# EAGLE design Antlaz-v0.1 (EAGLE 8.2.0)
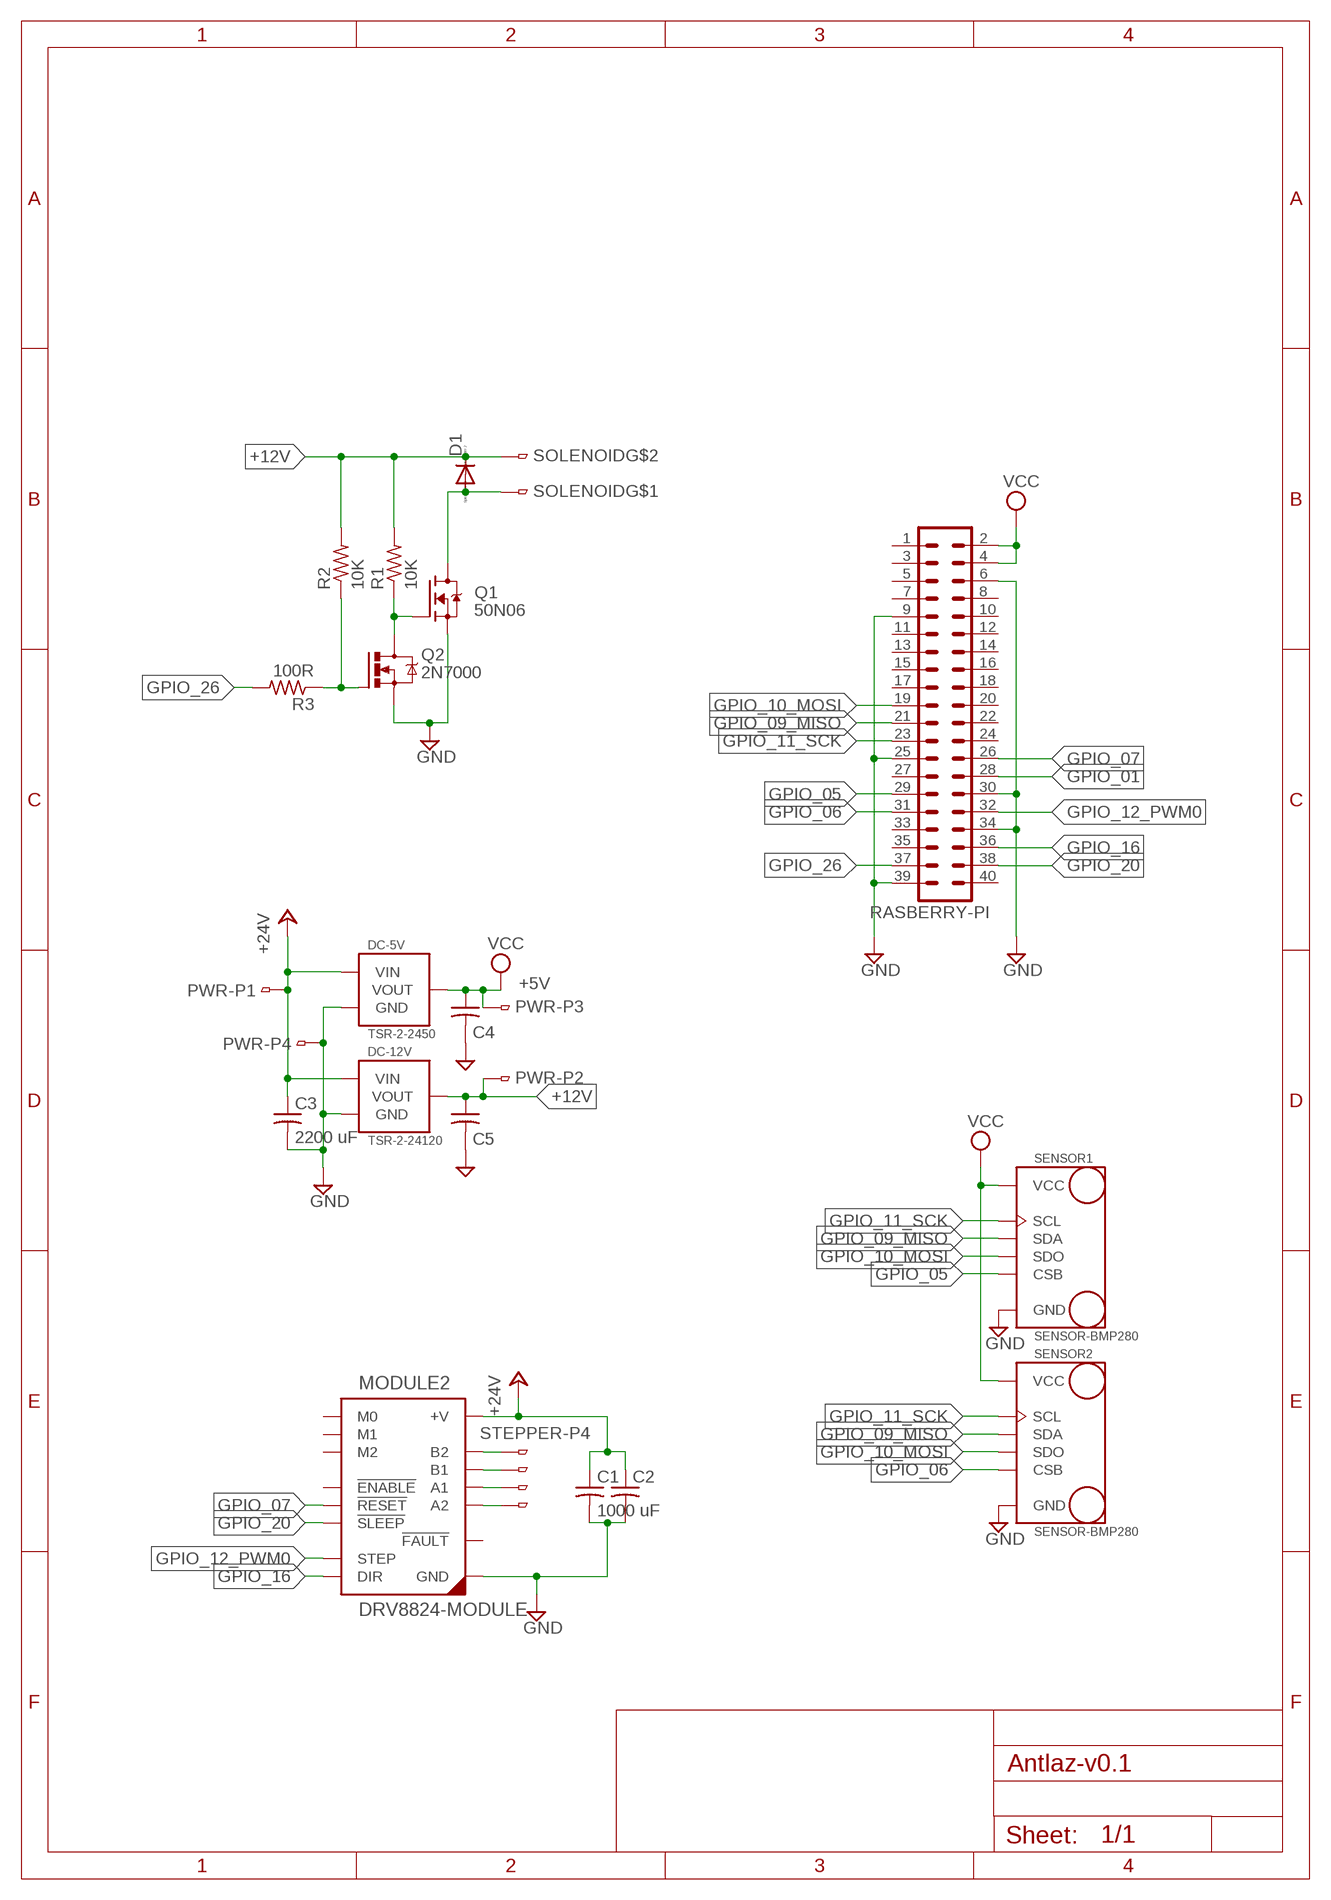
[diagram p0: schematic, sheet 1]

## Parts
C1  1000 uF  C-US_DIA-18MM  [CAP_18MM]
C2  C-US_BYPASS  [KEMET-CERMAIC]
C3  2200 uF  C-US_DIA-18MM  [CAP_18MM]
C4  C-US_BYPASS  [KEMET-CERMAIC]
C5  C-US_BYPASS  [KEMET-CERMAIC]
D1  DIODEDO07  [DO07]
DC-5V  TSR-2-2450  DC-DC_MODULE-TSR_2  [DCDC_TSR2]
DC-12V  TSR-2-24120  DC-DC_MODULE-TSR_2  [DCDC_TSR2]
MODULE2  DRV8824-MODULE  [DRV8825]
PWR  CONN-4  [CONN-PHEONIX-3,5MM-4]
Q1  50N06  NMOSFET_  [TO220]
Q2  2N7000  NMOSFET_TO92  [TO92]
R1  10K  R-US_0207/10  [0207/10]
R2  10K  R-US_0207/10  [0207/10]
R3  100R  R-US_0207/10  [0207/10]
RASBERRY-PI  MA20-2  [MA20-2]
SENSOR1  SENSOR-BMP280  [MA06-1]
SENSOR2  SENSOR-BMP280  [MA06-1]
SOLENOID  CONN-2  [CONN-PHEONIX-3,5MM-2]
STEPPER  CONN-4  [CONN-PHEONIX-3,5MM-4]

## Nets
+12V: C5.1 D1.C DC-12V.P$3(VOUT) PWR.P$2 R1.2 R2.2 SOLENOID.P$2
+24V: C1.1 C2.1 C3.1 DC-5V.P$1(VIN) DC-12V.P$1(VIN) MODULE2.P$16(+V) PWR.P$1
GND: C1.2 C2.2 C3.2 C4.2 C5.2 DC-5V.P$2(GND) DC-12V.P$2(GND) MODULE2.P$9(GND) MODULE2.P$15(GND) PWR.P$4 Q1.3(S) Q2.3(S) RASBERRY-PI.6 RASBERRY-PI.9 RASBERRY-PI.25 RASBERRY-PI.30 RASBERRY-PI.34 RASBERRY-PI.39 SENSOR1.2(GND) SENSOR2.2(GND)
GPIO_01: RASBERRY-PI.28
GPIO_05: RASBERRY-PI.29 SENSOR1.5(CSB)
GPIO_06: RASBERRY-PI.31 SENSOR2.5(CSB)
GPIO_07: MODULE2.P$5(!RESET) RASBERRY-PI.26
GPIO_09_MISO: RASBERRY-PI.21 SENSOR1.4(SDA) SENSOR2.4(SDA)
GPIO_10_MOSI: RASBERRY-PI.19 SENSOR1.6(SDO) SENSOR2.6(SDO)
GPIO_11_SCK: RASBERRY-PI.23 SENSOR1.3(SCL) SENSOR2.3(SCL)
GPIO_12_PWM0: MODULE2.P$7(STEP) RASBERRY-PI.32
GPIO_16: MODULE2.P$8(DIR) RASBERRY-PI.36
GPIO_20: MODULE2.P$6(!SLEEP) RASBERRY-PI.38
GPIO_26: R3.2 RASBERRY-PI.37
N$1: Q2.2(G) R2.1 R3.1
N$3: MODULE2.P$14(B2) STEPPER.P$4
N$4: MODULE2.P$13(B1) STEPPER.P$3
N$5: MODULE2.P$12(A1) STEPPER.P$2
N$7: MODULE2.P$11(A2) STEPPER.P$1
N$8: D1.A Q1.2(D) SOLENOID.P$1
N$9: Q1.1(G) Q2.1(D) R1.1
VCC: C4.1 DC-5V.P$3(VOUT) PWR.P$3 RASBERRY-PI.2 RASBERRY-PI.4 SENSOR1.1(VCC) SENSOR2.1(VCC)
Unconnected: MODULE2.P$1(!ENABLE) MODULE2.P$2(M0) MODULE2.P$3(M1) MODULE2.P$4(M2) MODULE2.P$10(!FAULT) RASBERRY-PI.1 RASBERRY-PI.3 RASBERRY-PI.5 RASBERRY-PI.7 RASBERRY-PI.8 RASBERRY-PI.10 RASBERRY-PI.11 RASBERRY-PI.12 RASBERRY-PI.13 RASBERRY-PI.14 RASBERRY-PI.15 RASBERRY-PI.16 RASBERRY-PI.17 RASBERRY-PI.18 RASBERRY-PI.20 RASBERRY-PI.22 RASBERRY-PI.24 RASBERRY-PI.27 RASBERRY-PI.33 RASBERRY-PI.35 RASBERRY-PI.40

## Notes on the sheet
- +5V

## Library data of the parts
C1-C5 = 1M-Vent-PAPR:C-US_: CAPACITOR, American symbol
D1 = Lil-Makers:DIODE: DIODE
DC-5V DC-12V = 1M-Vent-PAPR:DC-DC_MODULE
MODULE2 = 1M-Vent-PAPR:DRV8824-MODULE
PWR STEPPER = 1M-Vent-PAPR:CONN-4
Q1 = 1M-Vent-PAPR:NMOSFET_
Q2 = Transistor:NMOSFET: N-Channel MOSFET - Generic; CATEGORY: Transistor; SUB-CATEGORY: MOSFET; TYPE: N-Channel
R1-R3 = 1M-Vent-PAPR:R-US_: RESISTOR, American symbol
RASBERRY-PI = con-lstb:MA20-2: PIN HEADER; OC_FARNELL: unknown; OC_NEWARK: unknown
SENSOR1 SENSOR2 = 1M-Vent-PAPR:SENSOR-BMP280
SOLENOID = 1M-Vent-PAPR:CONN-2

## Board
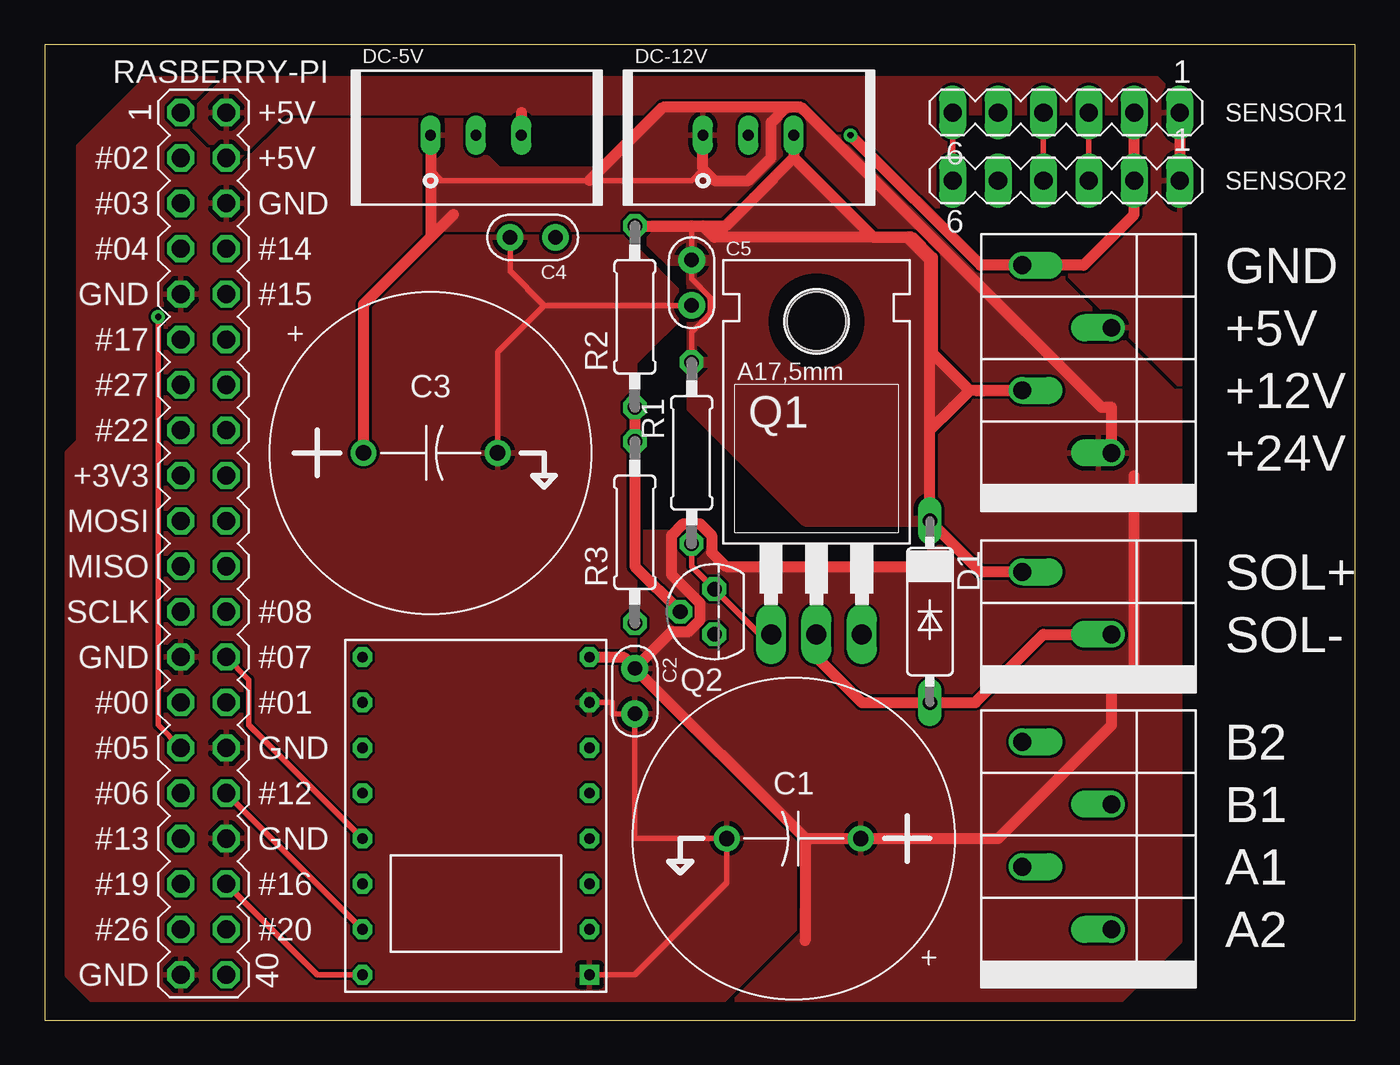
[diagram p1: board, top side]
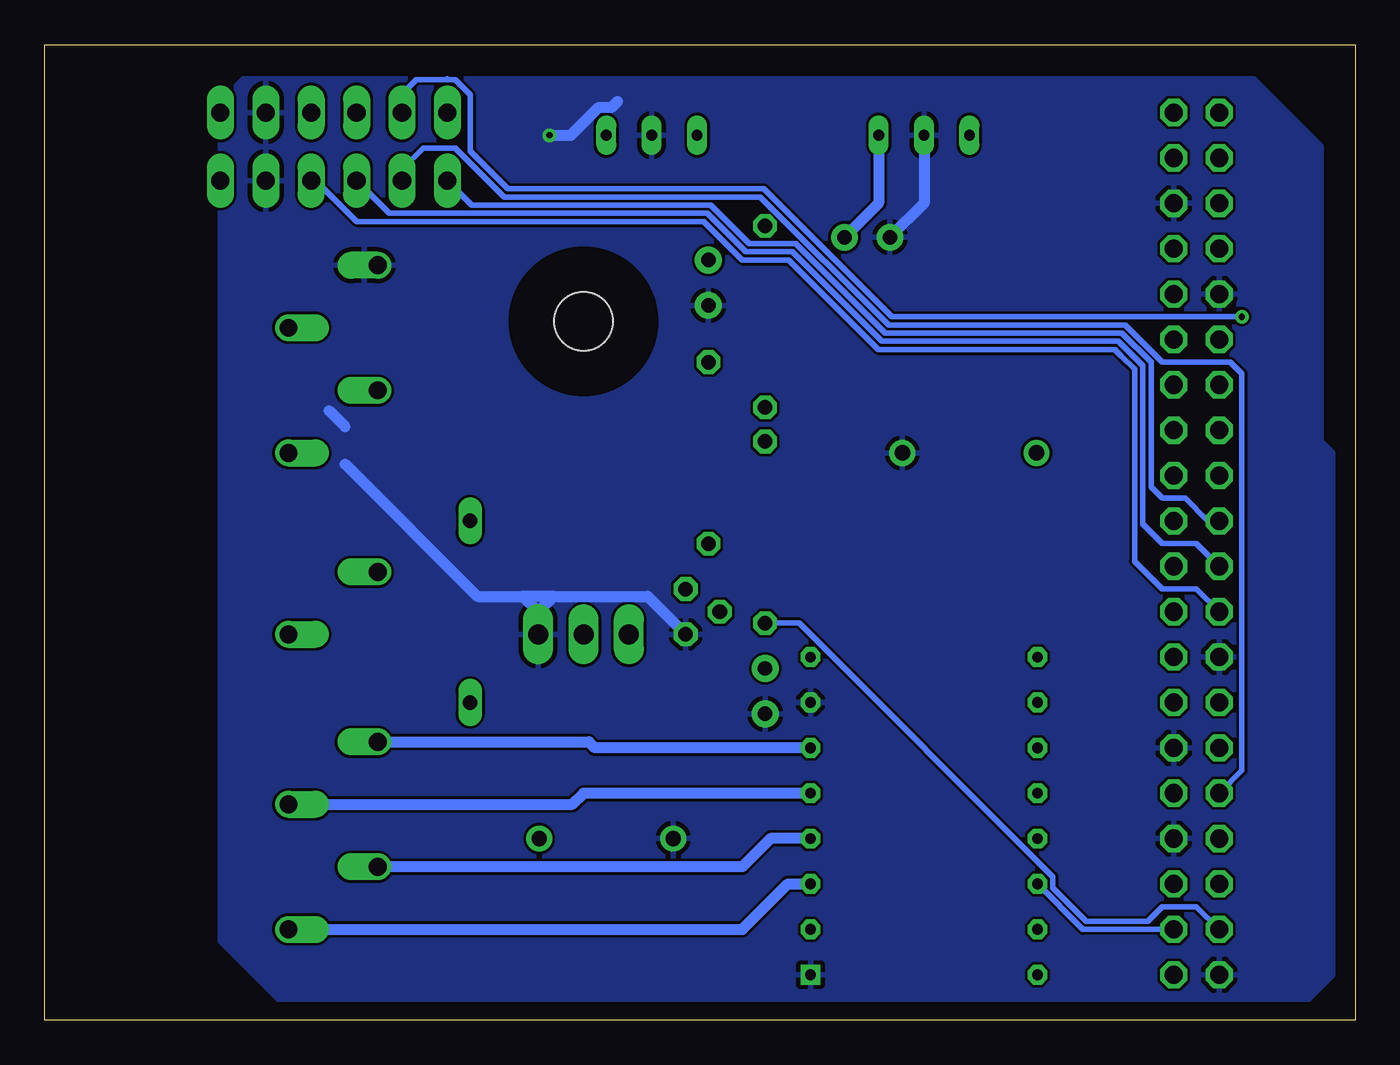
[diagram p2: board, bottom side, seen from below]

Size 73.33 x 54.6 mm. Coordinates in mm from the lower left corner, seen from the top.
Outline: 0,0 73.33,0 73.33,54.6 0,54.6 0,0
Copper layers (1*16): Top 0.035mm / dielectric 1.5mm / Bottom 0.035mm
Design rules "default": minimum track width 6mil, minimum drill 0.35mm, track to track 6mil, track to pad 6mil, pad to pad 6mil, via to via 6mil, smd to smd 6mil, copper to edge 40mil, drill to drill 6mil, minimum pad ring 10mil, minimum via ring 8mil, stop-mask expansion 4mil, vias tented up to drill 0mil, thermal gap 10mil

### Footprints (pad centres in the part's own frame; a part is rotated, then mirrored left to right if it is on the bottom)
CAP_18MM = drill 0.85 pad 1.45: 1 -3.75,0; 2 3.75,0
KEMET-CERMAIC = drill 0.8 pad 1.5: 1 -1.27,0; 2 1.27,0
DO07 = drill 0.813 long: A 5.08,0; C -5.08,0
DCDC_TSR2 = drill 0.6 long: P$1 -2.54,0; P$2 0,0; P$3 2.54,0
DRV8825 = drill 0.6 octagon: P$1 -6.35,6.35; P$2 -6.35,3.81; P$3 -6.35,1.27; P$4 -6.35,-1.27; P$5 -6.35,-3.81; P$6 -6.35,-6.35; P$7 -6.35,-8.89; P$8 -6.35,-11.43; P$10 6.35,-8.89; P$11 6.35,-6.35; P$12 6.35,-3.81; P$13 6.35,-1.27; P$14 6.35,1.27; P$15 6.35,3.81; P$16 6.35,6.35 | drill 0.6 square: P$9 6.35,-11.43
CONN-PHEONIX-3,5MM-4 = drill 1 offset: P$1 0,0; P$2 3.5,5; P$3 7,0; P$4 10.5,5
TO220 = drill 1.118 long: 1 -2.54,-6.35; 2 0,-6.35; 3 2.54,-6.35 | hole 3.302: 0,11.176
TO92 = drill 0.813 octagon: 1 1.27,0; 2 0,1.905; 3 -1.27,0
0207/10 = drill 0.813 octagon: 1 -5.08,0; 2 5.08,0
MA20-2 = drill 1.016 octagon: 1 -24.13,-1.27; 2 -24.13,1.27; 3 -21.59,-1.27; 4 -21.59,1.27; 5 -19.05,-1.27; 6 -19.05,1.27; 7 -16.51,-1.27; 8 -16.51,1.27; 9 -13.97,-1.27; 10 -13.97,1.27; 11 -11.43,-1.27; 12 -11.43,1.27; 13 -8.89,-1.27; 14 -8.89,1.27; 15 -6.35,-1.27; 16 -6.35,1.27; 17 -3.81,-1.27; 18 -3.81,1.27; 19 -1.27,-1.27; 20 -1.27,1.27; 21 1.27,-1.27; 22 1.27,1.27; 23 3.81,-1.27; 24 3.81,1.27; 25 6.35,-1.27; 26 6.35,1.27; 27 8.89,-1.27; 28 8.89,1.27; 29 11.43,-1.27; 30 11.43,1.27; 31 13.97,-1.27; 32 13.97,1.27; 33 16.51,-1.27; 34 16.51,1.27; 35 19.05,-1.27; 36 19.05,1.27; 37 21.59,-1.27; 38 21.59,1.27; 39 24.13,-1.27; 40 24.13,1.27
MA06-1 = drill 1.016 long: 1 -6.35,0; 2 -3.81,0; 3 -1.27,0; 4 1.27,0; 5 3.81,0; 6 6.35,0
CONN-PHEONIX-3,5MM-2 = drill 1 offset: P$1 0,0; P$2 3.5,5

### Placement (x,y rotation side)
C1  41.91,10.16 180 top
C2  33.02,18.41 270 top
C3  21.59,31.75 0 top
C4  27.3,43.81 180 top
C5  36.2,41.27 270 top
D1  49.53,22.86 270 top
DC-5V  24.13,49.53 0 top
DC-12V  39.37,49.53 0 top
MODULE2  24.13,13.97 0 top
PWR  59.69,31.75 90 top
Q1  43.18,27.94 0 top
Q2  37.47,22.86 90 top
R1  36.2,31.75 90 top
R2  33.02,39.37 90 top
R3  33.02,27.3 270 top
RASBERRY-PI  8.89,26.67 270 top
SENSOR1  57.15,50.8 180 top
SENSOR2  57.15,46.99 180 top
SOLENOID  59.69,21.59 90 top
STEPPER  59.69,5.08 90 top

### Tracks (layer width: path | path; a pad name or v marks a point on that pad's centre or on a via)
+12V
  Top 0.305: R1.2 36.2,38.51 37.25,39.57 37.25,40.44 36.2,41.5 C5.1 36.2,44.45 | 34.29,44.45 R2.2 | 52.07,35.25 51.74,35.25 51.74,35.23 50.8,34.29
  Top 0.61: SOLENOID.P$2 52.38,25.09 D1.C 49.53,33.02 | 39.69,46.04 37.47,43.81 | 39.69,46.04 41.91,48.26 | DC-12V.P$3 41.91,48.26 | 41.91,48.26 46.35,43.81 | 46.35,43.81 48.26,43.81 | 48.26,43.81 48.53,43.81 49.67,42.68 49.67,37.33 51.74,35.25 | 52.07,35.25 PWR.P$2 51.76,35.25 50.8,34.29 49.53,33.02 | 46.35,43.81 37.47,43.81 | 48.26,43.81 49.53,42.55 49.53,33.02 | R2.2 36.2,44.45 | 36.2,44.45 36.83,44.45 37.47,43.81 | 36.2,44.45 38.1,44.45 39.69,46.04
  pour Top: 49.53,27.94 49.53,33.02 51.44,34.92 51.44,35.56 49.53,37.47 49.53,42.55 48.26,43.81 46.35,43.81 41.91,48.26 38.1,44.45 33.02,44.45 36.2,41.27 36.2,34.29 42.55,27.94
+24V
  Top 0.305: 32.38,20.32 C2.1 33.34,19.37 42.55,10.16 | 21.59,46.99 21.59,43.81 | 21.59,46.99 21.59,47.62 | 21.59,47.62 DC-5V.P$1 | 22.23,46.99 30.48,46.99 36.2,46.99 36.83,47.62 | 22.23,46.99 21.59,46.99 | 21.59,47.62 22.23,46.99
  Top 0.61: DC-12V.P$1 36.83,47.62 37.47,46.99 39.37,46.99 40.64,48.26 40.64,50.24 41.49,51.09 | PWR.P$1 59.69,34.29 59.13,34.29 42.33,51.09 41.49,51.09 | DC-5V.P$1 21.59,43.81 | 21.59,43.81 17.84,40.06 C3.1 | MODULE2.P$16 32.38,20.32 33.34,19.37 | 42.55,10.16 C2.1 35.08,21.74 36.02,21.74 36.68,22.4 36.68,23.32 35.08,24.92 35.08,27.13 35.73,27.79 36.66,27.79 37.31,27.13 37.31,26.19 38.1,25.4 50.16,25.4 | 42.55,10.16 C1.1 53.34,10.16 59.69,16.51 59.69,18.41 60.96,19.68 60.96,30.48 | 21.59,43.81 22.86,45.09 | 42.55,10.16 42.55,4.45 | 41.49,51.09 34.59,51.09 30.48,46.99
  pour Top (rank 4): 21.59,43.81 21.59,50.8 23.5,50.8 24.13,50.16 24.13,48.9 25.4,47.62 31.75,47.62 35.56,51.44 42.55,51.44 52.07,42.55 56.52,42.55 59.69,39.37 59.69,38.1 60.33,38.73 63.5,35.56 63.5,4.45 59.69,0.64 36.83,0.64 42.55,6.35 42.55,10.16 33.02,19.68 33.02,27.3 36.2,27.3 38.1,25.4 49.53,25.4 49.53,42.55 48.26,43.81 36.83,44.45 33.02,44.45 32.38,43.81
GND  (via drill 0.35)
  Top 0.305: MODULE2.P$9 33.02,2.54 38.16,7.68 C1.2 33.02,10.16 C2.2 31.75,17.14 31.75,17.78 MODULE2.P$15 | C4.2 26.04,41.91 27.94,40.01 | 27.94,40.01 C5.2 | C3.2 25.34,37.41 27.94,40.01
  Top 0.61: SENSOR1.2 SENSOR2.2 60.96,45.09 58.12,42.25 PWR.P$4 52.37,42.25 v45.09,49.53
  Bottom 0.61: 45.72,22.86 44.86,23.72 | Q2.3 39.6,23.72 44.86,23.72 | Q1.3 45.72,22.86 | 44.86,23.72 46.58,23.72 | 46.58,23.72 49.12,23.72 56.52,31.11 | 46.58,23.72 45.72,22.86 | 57.41,34.11 56.52,33.22 | DC-5V.P$2 24.13,45.72 C4.2 | 41.27,51.44 41.62,51.09 42.33,51.09 43.89,49.53 v45.09,49.53
  pour Top (rank 3): 36.2,40.01 32.38,43.81 21.59,43.81 21.59,50.8 12.06,50.8 10.16,52.7 5.71,52.7 1.91,48.9 1.91,32.38 1.27,31.75 1.27,2.54 3.17,0.64 37.47,0.64 42.55,5.71 42.55,10.16 33.02,19.68 33.02,36.83
  pour Bottom: 1.27,2.54 3.17,0.64 59.69,0.64 63.5,4.45 63.5,51.44 62.23,52.7 5.71,52.7 1.91,48.9 1.91,32.38 1.27,31.75
GPIO_05  (via drill 0.35)
  Top 0.305: RASBERRY-PI.29 6.35,16.51 v6.35,39.37
  Bottom 0.305: 50.72,52.63 50.36,52.63 49.53,51.8 49.53,48.64 47.43,46.53 33.09,46.53 25.93,39.37 v6.35,39.37 | 50.72,52.63 50.8,52.7 | SENSOR1.5 53.34,51.82 52.53,52.63 50.72,52.63
GPIO_06
  Bottom 0.305: RASBERRY-PI.31 6.35,13.97 6.35,36.2 6.99,36.83 10.79,36.83 12.88,38.91 26.12,38.91 33.28,46.08 47.62,46.08 50.36,48.82 52.15,48.82 53.34,47.62 SENSOR2.5
GPIO_07
  Top 0.305: RASBERRY-PI.26 11.43,19.05 11.43,16.51 MODULE2.P$5
GPIO_09_MISO
  Top 0.305: SENSOR1.4 SENSOR2.4
  Bottom 0.305: RASBERRY-PI.21 8.89,26.67 10.79,26.67 11.89,27.76 11.89,36.63 12.89,37.64 | 12.89,37.64 | 12.89,37.64 13.26,38 26.5,38 31.5,43 34.1,43 36.26,45.16 54.05,45.16 SENSOR2.4
GPIO_10_MOSI
  Top 0.305: SENSOR1.6 SENSOR2.6
  Bottom 0.305: RASBERRY-PI.19 8.26,27.94 9.53,29.21 10.79,29.21 11.43,29.84 11.43,36.82 13.07,38.46 26.31,38.46 31.31,43.46 33.02,43.46 | SENSOR2.6 49.43,45.62 36.07,45.62 33.91,43.46 33.02,43.46 | 33.28,43.46 33.02,43.46
GPIO_11_SCK
  Top 0.305: SENSOR1.3 SENSOR2.3
  Bottom 0.305: SENSOR2.3 58.15,46.99 55.87,44.7 36.45,44.7 36.2,44.45 34.29,42.55 31.69,42.55 26.69,37.54 13.45,37.54 13.09,37.18 | 13.09,37.18 | RASBERRY-PI.23 8.89,24.13 10.79,24.13 12.34,25.68 12.34,36.44 13.09,37.18
GPIO_12_PWM0
  Top 0.305: MODULE2.P$7 RASBERRY-PI.32
GPIO_16
  Top 0.305: MODULE2.P$8 15.24,2.54 RASBERRY-PI.36
GPIO_20
  Bottom 0.305: RASBERRY-PI.38 15.24,5.08 MODULE2.P$6
GPIO_26
  Bottom 0.305: RASBERRY-PI.37 8.89,6.35 10.16,6.35 | R3.2 31.11,22.23 16.92,8.03 16.92,7.41 15.05,5.54 11.61,5.54 10.79,6.35 10.16,6.35 | 10.16,6.35 10.4,6.35
N$1
  Top 0.61: R2.1 R3.1 33.02,25.4 Q2.2
N$3
  Bottom 0.61: MODULE2.P$14 42.55,15.24 42.88,15.58 STEPPER.P$4
N$4
  Bottom 0.61: MODULE2.P$13 43.18,12.7 43.8,12.08 STEPPER.P$3
N$5
  Bottom 0.61: MODULE2.P$12 32.71,10.16 34.29,8.58 STEPPER.P$2
N$7
  Bottom 0.61: STEPPER.P$1 34.29,5.08 31.75,7.62 MODULE2.P$11
N$8
  Top 0.305: 45.72,17.78 D1.A 50.16,17.78 52.07,17.78
  Top 0.61: Q1.2 43.18,20.32 45.72,17.78 50.16,17.78 | D1.A 52.07,17.78 55.88,21.59 SOLENOID.P$1
N$9
  Top 0.305: R1.1 36.2,25.4 Q2.1 40.01,21.59 Q1.1
VCC
  Top 0.61: SENSOR1.1 SENSOR2.1 | 26.67,50.8 DC-5V.P$3
  Bottom 0.61: DC-5V.P$3 26.67,45.72 C4.1
  pour Top: 8.26,50.8 10.16,52.7 62.23,52.7 63.5,51.44 63.5,35.56 56.52,42.55 58.42,42.55 60.96,45.09 60.96,50.8 50.8,50.8 50.8,46.35 49.53,45.09 48.9,45.09 42.55,51.44 34.29,51.44 33.66,50.8 27.3,50.8 26.67,50.16 26.04,50.8 13.34,50.8 10.79,48.26 10.16,48.26 8.26,50.16

### Text on the board
tNames: +5V | #02 | +5V | #03 | GND | #04 | #14 | GND | GND | #15 | +5V | #17 | #27 | +12V | #22 | +24V | +3V3 | MOSI | MISO | SOL+ | SCLK | #08 | SOL- | GND | #07 | #00 | #01 | B2 | #05 | GND | #06 | #12 | B1 | #13 | GND | A1 | #19 | #16 | #26 | #20 | A2 | GND